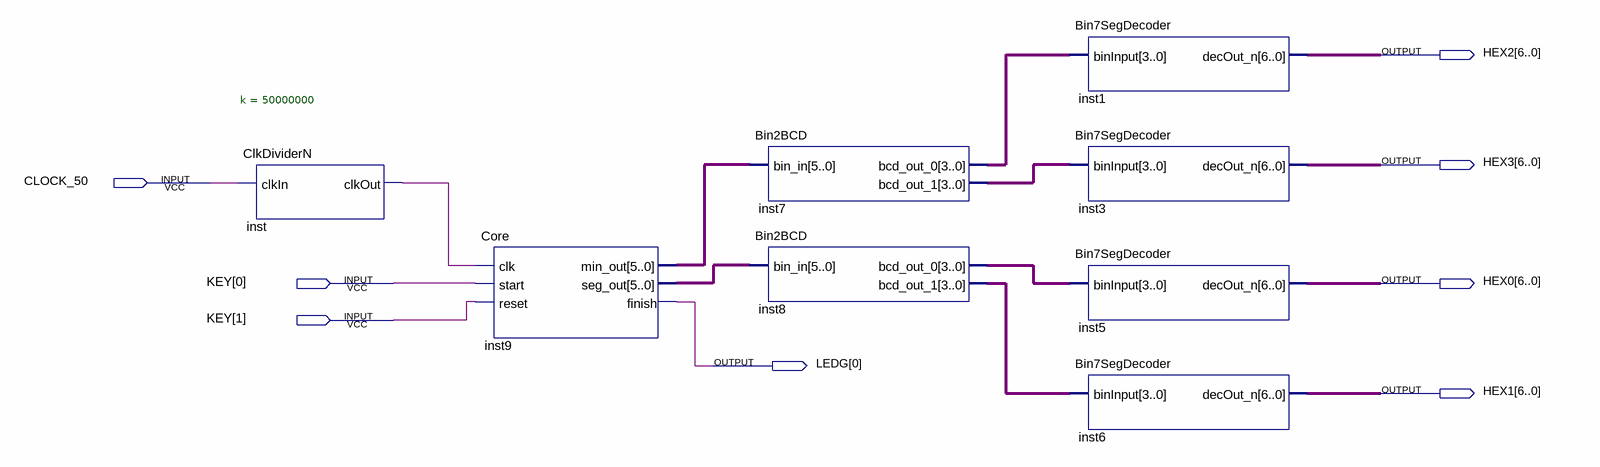
[diagram p0: schematic sheet]
// Quartus schematic mp_esq.bdf as structural Verilog: 8 symbols, 8 pins
module mp_esq (
  input  CLOCK_50,
  input  [1:0] KEY,
  output [6:0] HEX2,
  output [6:0] HEX3,
  output [6:0] HEX0,
  output [0:0] LEDG,
  output [6:0] HEX1
);

  wire inst_clkout;
  wire [3:0] inst7_bcd_out_0, inst7_bcd_out_1, inst8_bcd_out_0, inst8_bcd_out_1;
  wire [5:0] inst9_min_out, inst9_seg_out;

  ClkDividerN #(.k(50000000)) inst (.clkIn(CLOCK_50), .clkOut(inst_clkout));
  Core inst9 (
    .clk(inst_clkout), .start(KEY[0]), .reset(KEY[1]), .min_out(inst9_min_out), .seg_out(inst9_seg_out),
    .finish(LEDG[0]));
  Bin2BCD inst7 (.bin_in(inst9_min_out), .bcd_out_0(inst7_bcd_out_0), .bcd_out_1(inst7_bcd_out_1));
  Bin2BCD inst8 (.bin_in(inst9_seg_out), .bcd_out_0(inst8_bcd_out_0), .bcd_out_1(inst8_bcd_out_1));
  Bin7SegDecoder inst1 (.binInput(inst7_bcd_out_0), .decOut_n(HEX2));
  Bin7SegDecoder inst3 (.binInput(inst7_bcd_out_1), .decOut_n(HEX3));
  Bin7SegDecoder inst5 (.binInput(inst8_bcd_out_0), .decOut_n(HEX0));
  Bin7SegDecoder inst6 (.binInput(inst8_bcd_out_1), .decOut_n(HEX1));
endmodule
